# Altium schematic sheet 12V_Load_Switches.SchDoc: Title
size A3; Project: Q24 VCU; ENG_APP_DATE: --/--/--; DSN_APP_DATE: --/--/--; CHK_APP_DATE: --/--/--; Date: *******; ApprovedBy: *******; CheckedBy: None; Author: *******; CompanyName: *******; DrawnBy: Jacob Chisholm; Engineer: *******; Organization: *******; Address1: *******; Address2: *******; Address3: *******; Address4: *******; DocumentNumber: 8; Revision: *******; SheetNumber: 8; SheetTotal: 14; Address_Website: https://jchisholm204.github.io; E-Mail: JacobChisholm1010@gmail.com; CurrentTime: *******; CurrentDate: *******; Time: *******; DocumentFullPathAndName: *******; DocumentName: *******; ModifiedDate: *******; ImagePath: *******; ProjectName: *******; Application_BuildNumber: *******
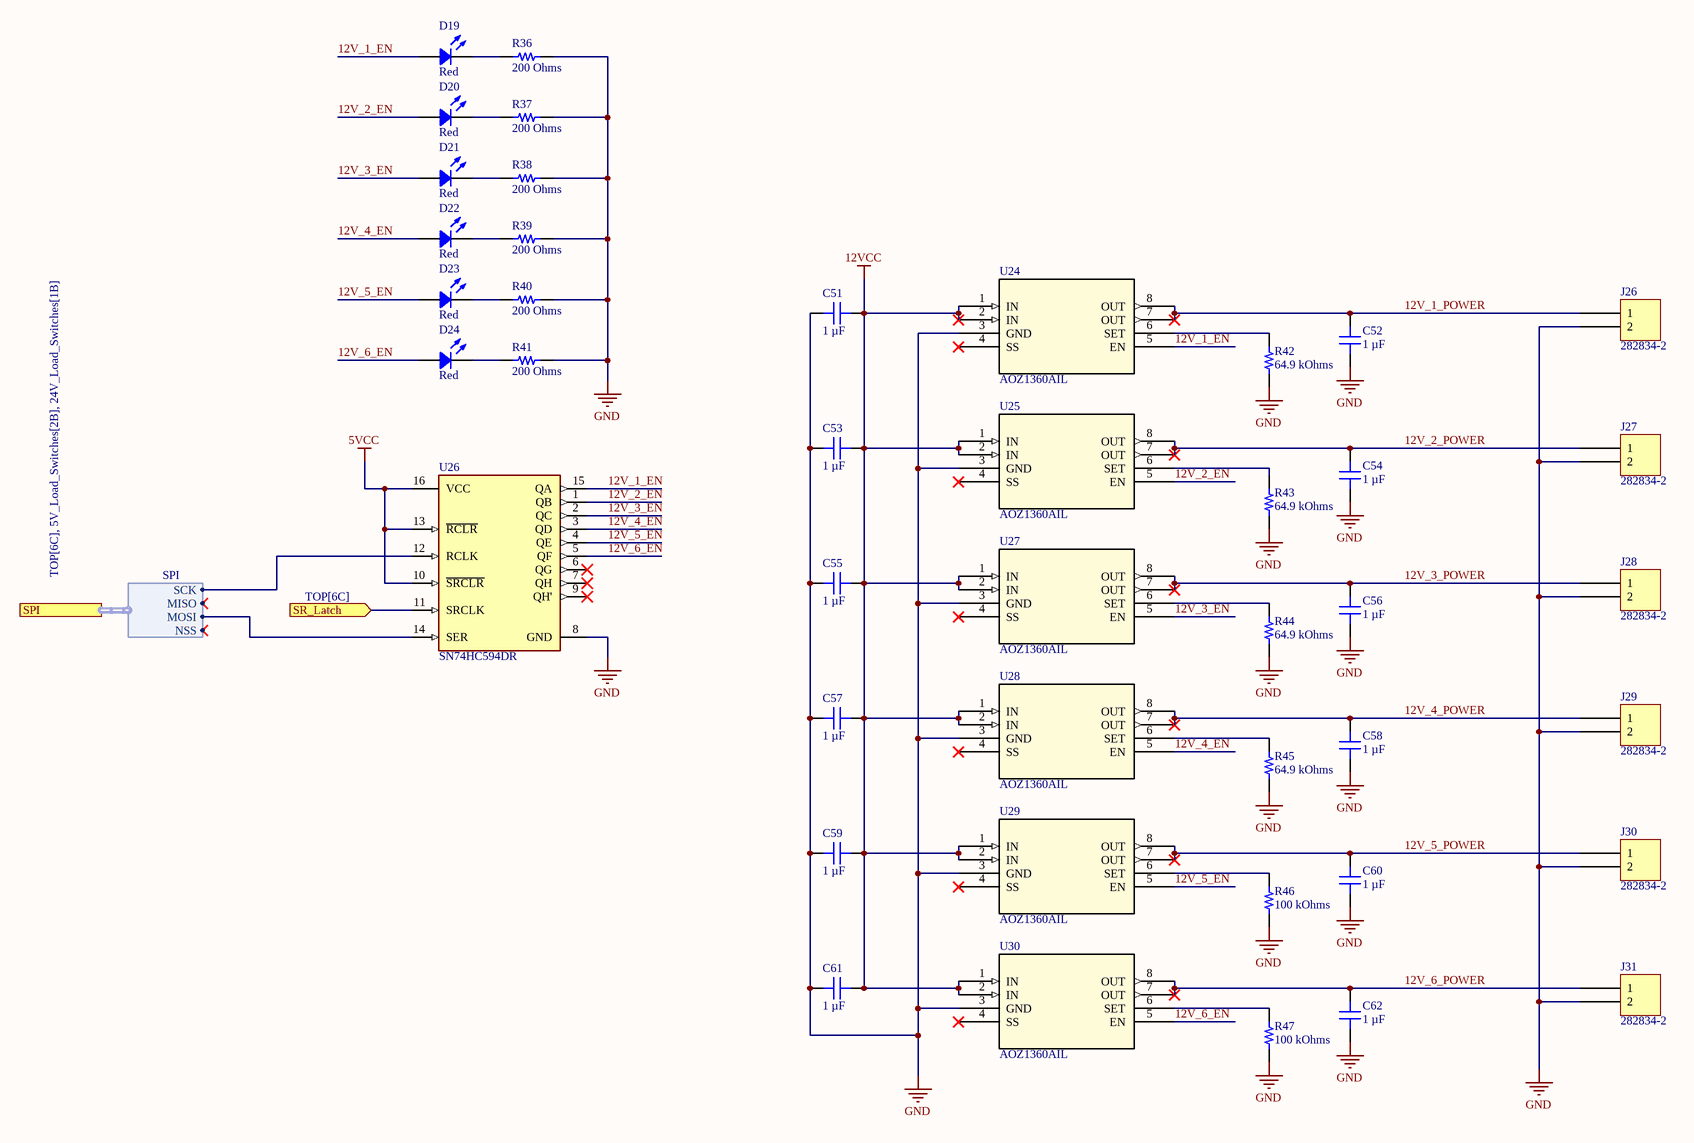
[diagram p0: 12V_Load_Switches.SchDoc]

## Parts
C51  1 µF  [CAP 0805_2012]
C52  1 µF  [CAP 0805_2012]
C53  1 µF  [CAP 0805_2012]
C54  1 µF  [CAP 0805_2012]
C55  1 µF  [CAP 0805_2012]
C56  1 µF  [CAP 0805_2012]
C57  1 µF  [CAP 0805_2012]
C58  1 µF  [CAP 0805_2012]
C59  1 µF  [CAP 0805_2012]
C60  1 µF  [CAP 0805_2012]
C61  1 µF  [CAP 0805_2012]
C62  1 µF  [CAP 0805_2012]
D19  Red  [LED 0603_1608 RED]
D20  Red  [LED 0603_1608 RED]
D21  Red  [LED 0603_1608 RED]
D22  Red  [LED 0603_1608 RED]
D23  Red  [LED 0603_1608 RED]
D24  Red  [LED 0603_1608 RED]
J26  282834-2  [TE 282834-2]
J27  282834-2  [TE 282834-2]
J28  282834-2  [TE 282834-2]
J29  282834-2  [TE 282834-2]
J30  282834-2  [TE 282834-2]
J31  282834-2  [TE 282834-2]
R36  200 Ohms  [RES 0603_1608]
R37  200 Ohms  [RES 0603_1608]
R38  200 Ohms  [RES 0603_1608]
R39  200 Ohms  [RES 0603_1608]
R40  200 Ohms  [RES 0603_1608]
R41  200 Ohms  [RES 0603_1608]
R42  64.9 kOhms  [RES 0603_1608]
R43  64.9 kOhms  [RES 0603_1608]
R44  64.9 kOhms  [RES 0603_1608]
R45  64.9 kOhms  [RES 0603_1608]
R46  100 kOhms  [RES 0603_1608]
R47  100 kOhms  [RES 0603_1608]
U24  AOZ1360AIL  [AOZ1360AIL_AOS]
U25  AOZ1360AIL  [AOZ1360AIL_AOS]
U26  SN74HC594DR  [FP-D0016A-IPC_A]
U27  AOZ1360AIL  [AOZ1360AIL_AOS]
U28  AOZ1360AIL  [AOZ1360AIL_AOS]
U29  AOZ1360AIL  [AOZ1360AIL_AOS]
U30  AOZ1360AIL  [AOZ1360AIL_AOS]

## Ports
SPI (harness SPI, see TOP[6C], 5V_Load_Switches[2B], 24V_Load_Switches[1B]), SR_Latch (in, see TOP[6C])

## Harnesses
SPI: NSS, SCK, MISO, MOSI

## Nets
5VCC: U26.10(~{SRCLR}) U26.13(~{RCLR}) U26.16(VCC)
12VCC: C51.1 C53.1 C55.1 C57.1 C59.1 C61.1 U24.1(IN) U24.2(IN) U25.1(IN) U25.2(IN) U27.1(IN) U27.2(IN) U28.1(IN) U28.2(IN) U29.1(IN) U29.2(IN) U30.1(IN) U30.2(IN)
GND: C51.2 C52.1 C53.2 C54.1 C55.2 C56.1 C57.2 C58.1 C59.2 C60.1 C61.2 C62.1 J26.2 J27.2 J28.2 J29.2 J30.2 J31.2 R36.2 R37.2 R38.2 R39.2 R40.2 R41.2 R42.1 R43.1 R44.1 R45.1 R46.1 R47.1 U24.3(GND) U25.3(GND) U26.8(GND) U27.3(GND) U28.3(GND) U29.3(GND) U30.3(GND)
12V_1_EN: D19.1 U24.5(EN) U26.15(QA)
12V_1_POWER: C52.2 J26.1 U24.7(OUT) U24.8(OUT)
12V_2_EN: D20.1 U25.5(EN) U26.1(QB)
12V_2_POWER: C54.2 J27.1 U25.7(OUT) U25.8(OUT)
12V_3_EN: D21.1 U26.2(QC) U27.5(EN)
12V_3_POWER: C56.2 J28.1 U27.7(OUT) U27.8(OUT)
12V_4_EN: D22.1 U26.3(QD) U28.5(EN)
12V_4_POWER: C58.2 J29.1 U28.7(OUT) U28.8(OUT)
12V_5_EN: D23.1 U26.4(QE) U29.5(EN)
12V_5_POWER: C60.2 J30.1 U29.7(OUT) U29.8(OUT)
12V_6_EN: D24.1 U26.5(QF) U30.5(EN)
12V_6_POWER: C62.2 J31.1 U30.7(OUT) U30.8(OUT)
SR_Latch: U26.11(SRCLK) ; port SR_Latch
NetD19_2: D19.2 R36.1
NetD20_2: D20.2 R37.1
NetD21_2: D21.2 R38.1
NetD22_2: D22.2 R39.1
NetD23_2: D23.2 R40.1
NetD24_2: D24.2 R41.1
NetR42_2: R42.2 U24.6(SET)
NetR43_2: R43.2 U25.6(SET)
NetR44_2: R44.2 U27.6(SET)
NetR45_2: R45.2 U28.6(SET)
NetR46_2: R46.2 U29.6(SET)
NetR47_2: R47.2 U30.6(SET)
NetU26_12: U26.12(RCLK) ; port SPI.SCK
NetU26_14: U26.14(SER) ; port SPI.MOSI

Not connected (* = marked no-connect by the designer): U24 4(SS)*; U25 4(SS)*; U26 6(QG)* 7(QH)* 9(QH')*; U27 4(SS)*; U28 4(SS)*; U29 4(SS)*; U30 4(SS)*

## Notes on the sheet
- Title:
- Drawn By:
- Page Contents:
- Checked By:
- Size:
- Date:
- File:
- License:
- Email:
- A3
- Number:
- Time:
- Revision:
- Sheet
- Website:
- of

## Library data of the parts
C51-C62 = GCJ21BR71H105KA01L: CAP CER 1UF 50V X7R 0805; manufacturer: Murata Electronics; Tolerance: ±10%; Part Number: GCJ21BR71H105KA01L; Value: 1 µF; Applications: Automotive, Boardflex Sensitive; Capacitance: 1 µF; componentlink1description: Datasheet; componentlink1url: https://www.murata.com/~/media/webrenewal/support/library/catalog/products/capacitor/mlcc/c03e.ashx?la=en-us; componentlink2description: DigiKey Link; componentlink2url: https://www.digikey.com/en/products/detail/murata-electronics/GCJ21BR71H105KA01L/4903512; Device Package: 0805 (2012 Metric); Features: Soft Termination; lastupdated: 12/20/2023 8:14:07 PM; Lifecycle Status: Active; Minimum Order: 1; Mounting Type: Surface Mount, MLCC; Operating Temperature: -55°C ~ 125°C; Package / Case: 0805 (2012 Metric); packaging: TapeAndReel; partid: 2709; Part Status: Active; price: 0.05; Ratings: AEC-Q200; series: GCJ; Size / Dimension: 0.079" L x 0.049" W (2.00mm x 1.25mm); Supplier 1: DigiKey; Supplier Part Number 1: 490-10667-1-ND; Temperature Coefficient: X7R; Thickness (Max): 0.057" (1.45mm); Voltage - Rated: 50V
D19-D24 = 19-213SDRC/S259/TR8: LED RED CLEAR 2SMD; Manufacturer: Everlight Electronics Co Ltd; Configuration: Standard; Current - Test: 10mA; Lens Color: Colorless; Lens Size: 1.20mm x 0.80mm; Lens Style: Rectangle with Flat Top; Viewing Angle: 120°; Voltage - Forward (Vf) (Typ): 2V; Wavelength - Peak: 650nm; Part Number: 19-213SDRC/S259/TR8; Color: Red; ComponentLink1Description: Datasheet; ComponentLink1URL: //media.digikey.com/pdf/Data%20Sheets/Everlight%20PDFs/19-213SDRC-S259-TR8.pdf; ComponentLink2Description: DigiKey Link; ComponentLink2URL: http://digikey.com/product-detail/en/everlight-electronics-co-ltd/19-213SDRC-S259-TR8/1080-1580-1-ND/8535303; Device Package: 0603 (1608 Metric); Height (Max): 0.70mm; LastUpdated: 2/2/2024 9:29:56 PM; Lens Transparency: Clear; Lifecycle Status: Active; Minimum Order: 1; Mounting Type: Surface Mount; Package / Case: 0603 (1608 Metric); Packaging: TapeAndReel; PartId: 372; Part Status: Active; Price: 0.06; Series: -; Size / Dimension: 1.60mm L x 0.80mm W; Supplier 1: DigiKey; Supplier Part Number 1: 1080-1580-1-ND; Supplier Device Package: 2-SMD; Value: Red
J26-J31 = 282834-2: TERM BLK 2P SIDE ENT 2.54MM PCB; Manufacturer: TE Connectivity AMP Connectors; Current: 10A; Mating Orientation: Horizontal with Board; Number of Levels: 1; Pitch: 0.100" (2.54mm); Positions Per Level: 2; Voltage: 150V; Wire Gauge: 16-30 AWG; Wire Termination: Screw - Rising Cage Clamp; Part Number: 282834-2; Color: Green; ComponentLink1Description: Datasheet; ComponentLink1URL: https://www.te.com/commerce/DocumentDelivery/DDEController?Action=srchrtrv&DocNm=282834&DocType=Customer+Drawing&DocLang=English; ComponentLink2Description: DigiKey Link; ComponentLink2URL: http://digikey.com/product-detail/en/te-connectivity-amp-connectors/282834-2/A98333-ND/1150135; LastUpdated: 1/15/2020 4:15:38 AM; Lifecycle Status: Active; Minimum Order: 1; Mounting Type: Through Hole; Packaging: Bulk; Part Status: Active; Price: 0.88; Series: Buchanan; Supplier 1: DigiKey; Supplier Part Number 1: A98333-ND
R36-R41 = RS73F1JTTD2000B: RES 200 OHM 0.1% 1/5W 0603; Manufacturer: KOA Speer Electronics, Inc.; Power (Watts): 0.2W, 1/5W; Temperature Coefficient: ±25ppm/°C; Part Number: RS73F1JTTD2000B; Value: 200 Ohms; ComponentLink1Description: Datasheet; ComponentLink1URL: http://www.koaspeer.com/pdfs/RS73.pdf; ComponentLink2Description: DigiKey Link; ComponentLink2URL: https://www.digikey.com/en/products/detail/koa-speer-electronics-inc/RS73F1JTTD2000B/11594419; Composition: Thick Film; Device Package: 0603 (1608 Metric); Features: Automotive AEC-Q200, Moisture Resistant; Height - Seated (Max): 0.022" (0.55mm); LastUpdated: 2/2/2024 8:38:37 PM; Lifecycle Status: Active; Minimum Order: 1; Number of Terminations: 2; Operating Temperature: -55°C ~ 155°C; Package / Case: 0603 (1608 Metric); Packaging: TapeAndReel; PartId: 56369; Part Status: Active; Price: 0.07; Ratings: AEC-Q200; Resistance: 200 Ohms; Series: RS73; Size / Dimension: 0.063" L x 0.031" W (1.60mm x 0.80mm); Supplier 1: DigiKey; Supplier Part Number 1: 2019-RS73F1JTTD2000BCT-ND; Supplier Device Package: 0603; Tolerance: ±0.1%
R42-R45 = 7-2176089-3: RES SMD 64.9K OHM 0.1% 1/6W 0603; Manufacturer: TE Connectivity Passive Product; Power (Watts): 0.167W, 1/6W; Temperature Coefficient: ±25ppm/°C; Part Number: 7-2176089-3; Value: 64.9 kOhms; ComponentLink1Description: Datasheet; ComponentLink1URL: https://www.te.com/commerce/DocumentDelivery/DDEController?Action=srchrtrv&DocNm=1773272&DocType=DS&DocLang=English; ComponentLink2Description: DigiKey Link; ComponentLink2URL: https://www.digikey.com/en/products/detail/te-connectivity-passive-product/7-2176089-3/4033750; Composition: Thin Film; Device Package: 0603 (1608 Metric); Height - Seated (Max): 0.022" (0.55mm); LastUpdated: 12/19/2023 8:39:23 PM; Lifecycle Status: Active; Minimum Order: 1; Number of Terminations: 2; Operating Temperature: -55°C ~ 155°C; Package / Case: 0603 (1608 Metric); Packaging: TapeAndReel; PartId: 23912; Part Status: Active; Price: 0.14; Resistance: 64.9 kOhms; Series: RP73P, Holsworthy; Size / Dimension: 0.061" L x 0.031" W (1.55mm x 0.80mm); Supplier 1: DigiKey; Supplier Part Number 1: A110282CT-ND; Supplier Device Package: 0603; Tolerance: ±0.1%
R46 R47 = AA0603FR-07100KL: RES SMD 100K OHM 1% 1/10W 0603; Manufacturer: Yageo; Power (Watts): 0.1W, 1/10W; Temperature Coefficient: ±150ppm/°C; Part Number: AA0603FR-07100KL; Value: 100 kOhms; ComponentLink1Description: Datasheet; ComponentLink1URL: https://www.yageo.com/upload/media/product/productsearch/datasheet/rchip/PYu-AA_51_RoHS_L_3.pdf; ComponentLink2Description: DigiKey Link; ComponentLink2URL: https://www.digikey.com/en/products/detail/yageo/AA0603FR-07100KL/5888687; Composition: Thick Film; Device Package: 0603 (1608 Metric); Features: Anti-Sulfur, Automotive AEC-Q200, Moisture Resistant; Height - Seated (Max): 0.022" (0.55mm); LastUpdated: 12/20/2023 8:36:28 PM; Lifecycle Status: Active; Minimum Order: 1; Number of Terminations: 2; Operating Temperature: -55°C ~ 155°C; Package / Case: 0603 (1608 Metric); Packaging: TapeAndReel; PartId: 78895; Price: 0.01; Ratings: AEC-Q200; Resistance: 100 kOhms; Series: AA; Size / Dimension: 0.063" L x 0.031" W (1.60mm x 0.80mm); Supplier 1: DigiKey; Supplier Part Number 1: 13-AA0603FR-07100KLCT-ND; Supplier Device Package: 0603; Tolerance: ±1%
U24 U25 U27-U30 = AOZ1360AIL: No Description Available; Mfr_Name: Alpha and Omega Semiconductor; Copyright: Copyright (C) 2023 Ultra Librarian. All rights reserved.; Manufacturer_Part_Number: AOZ1360AIL; RefDes: RefDes; Type: DEV
U26 = CMP-0780-00061-4: IC SHIFT REGISTER 8BIT 16-SOIC; Number of Bits per Element: 8; Min Supply Voltage: 2V; Frequency: 40MHz; Max Supply Voltage: 6V; Operating Supply Voltage: 5V; Number of Output Lines: 10; Propagation Delay: 25ns; Number of Elements: 1; Number of Circuits: 4; Direction: Unidirectional; Turn-On Delay Time: 185ns; RoHS Compliant: Yes; Width: 3.91mm; Length: 9.9mm; Min Operating Temperature: -40°C; Max Operating Temperature: 125°C; Package Quantity: 2500; Series: 74HC; Height: 1.58mm; Number of Bits: 8; Mount: Surface Mount; Logic Function: Shift Register; Radiation Hardening: No; Number of Pins: 16; Technology: CMOS; Packaging: Tape and Reel; Lead Free: Lead Free; Weight: 0.004998oz; REACH SVHC: No SVHC; Case/Package: SOIC